# Altium schematic sheet power.SchDoc
size A4
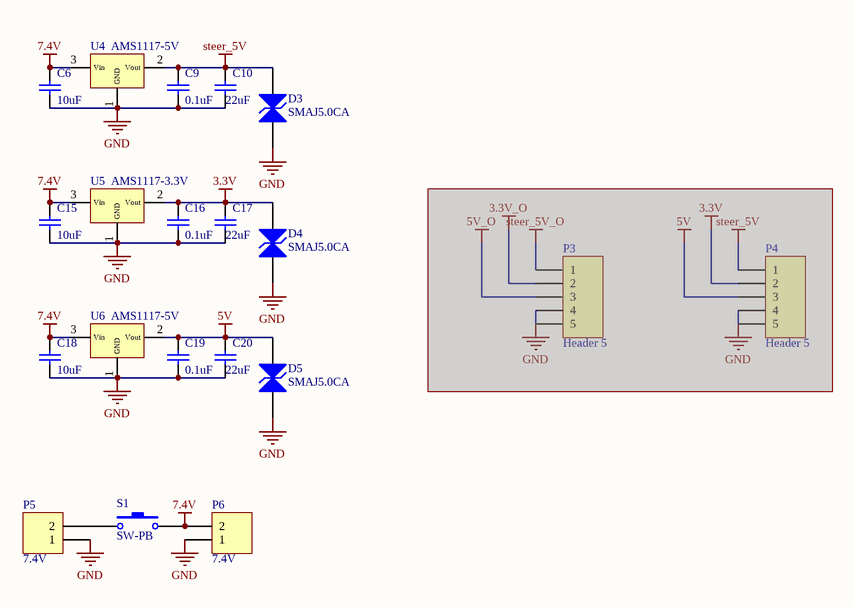
[diagram p0: power.SchDoc]

## Parts
C6  10uF  [C0603]
C9  0.1uF  [C0603]
C10  22uF  [C0603]
C15  10uF  [C0603]
C16  0.1uF  [C0603]
C17  22uF  [C0603]
C18  10uF  [C0603]
C19  0.1uF  [C0603]
C20  22uF  [C0603]
D3  SMAJ5.0CA  [DO-214AC]
D4  SMAJ5.0CA  [DO-214AC]
D5  SMAJ5.0CA  [DO-214AC]
P3  Header 5  [HDR1X5]  (masked out: inside a compile mask, not in the netlist)
P4  Header 5  [HDR1X5]  (masked out: inside a compile mask, not in the netlist)
P5  7.4V  [7.4V]
P6  7.4V  [7.4V]
S1  SW-PB  [7.4V]
U4  AMS1117-5V  [SOT-89]
U5  AMS1117-3.3V  [SOT-89]
U6  AMS1117-5V  [SOT-89]

## Nets
3.3V: C16.2 C17.2 D4.2(A2) U5.2(Vout)
5V: C19.2 C20.2 D5.2(A2) U6.2(Vout)
7.4V: C6.2 C15.2 C18.2 P6.2 S1.2 U4.3(Vin) U5.3(Vin) U6.3(Vin)
GND: C6.1 C9.1 C10.1 C15.1 C16.1 C17.1 C18.1 C19.1 C20.1 D3.1(A1) D4.1(A1) D5.1(A1) P5.1 P6.1 U4.1(GND) U5.1(GND) U6.1(GND)
steer_5V: C9.2 C10.2 D3.2(A2) U4.2(Vout)
NetP5_2: P5.2 S1.1

## Library data of the parts
C6 C9 C10 C15-C20 = Cap: Capacitor; Value: 100pF; Published: 8-Jun-2000; LatestRevisionDate: 17-Jul-2002; LatestRevisionNote: Re-released for DXP Platform.; PackageReference: RAD-0.3; Publisher: Altium Limited; PackageDescription: Radial Cap, Thru-Hole; 2 Leads; 0.3 in Pin Spacing
P3 P4 = Header 5: Header, 5-Pin; LatestRevisionDate: 17-Jul-2002; LatestRevisionNote: Re-released for DXP Platform.; Publisher: Altium Limited
P5 P6 = Header 2: Header, 2-Pin; LatestRevisionDate: 17-Jul-2002; LatestRevisionNote: Re-released for DXP Platform.; Publisher: Altium Limited
S1 = SW-PB: Switch; Published: 24-Mar-1999; LatestRevisionDate: 17-Jul-2002; LatestRevisionNote: Re-released for DXP Platform.; PackageReference: SPST-2; Publisher: Altium Limited; PackageDescription: Switch; 2 Leads
U4-U6 = AMS1117